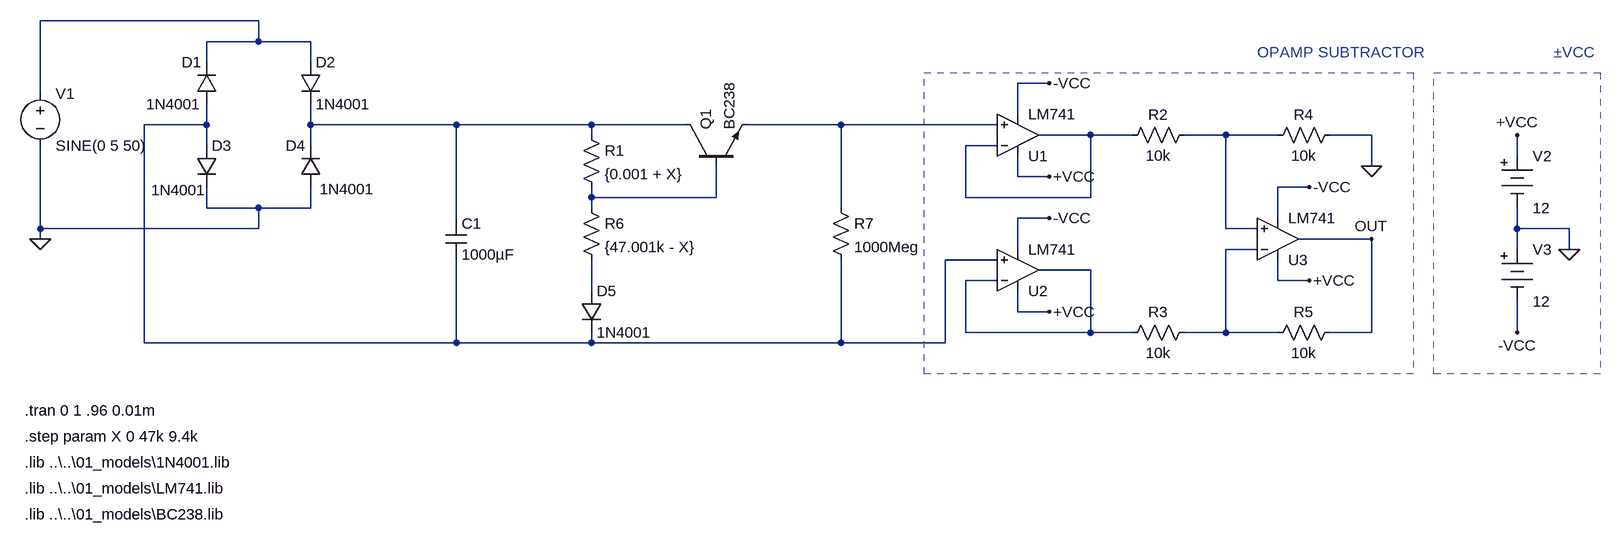
[diagram p0: schematic acdcconv_01_04_02_01_expcir_incrv_pot_simulated_vl.asc]
acdcconv_01_04_02_01_expcir_incrv_pot_simulated_vl.asc, the LTspice schematic file:
Version 4
SHEET 1 2228 872
WIRE 160 96 -176 96
WIRE 160 128 160 96
WIRE 160 128 80 128
WIRE 240 128 160 128
WIRE 80 160 80 128
WIRE 240 160 240 128
WIRE 1376 192 1328 192
WIRE -176 208 -176 96
WIRE 1328 240 1328 192
WIRE 80 256 80 224
WIRE 80 256 -16 256
WIRE 240 256 240 224
WIRE 464 256 240 256
WIRE 672 256 464 256
WIRE 816 256 672 256
WIRE 1056 256 912 256
WIRE 1296 256 1056 256
WIRE 672 272 672 256
WIRE 1440 272 1360 272
WIRE 1504 272 1440 272
WIRE 1648 272 1584 272
WIRE 1728 272 1648 272
WIRE 1872 272 1808 272
WIRE 80 288 80 256
WIRE 240 288 240 256
WIRE 1296 288 1248 288
WIRE 2096 304 2096 272
WIRE 1872 320 1872 272
WIRE 1328 336 1328 304
WIRE 1376 336 1328 336
WIRE 1776 352 1728 352
WIRE 672 368 672 352
WIRE 864 368 864 320
WIRE 864 368 672 368
WIRE 1248 368 1248 288
WIRE 1440 368 1440 272
WIRE 1440 368 1248 368
WIRE 80 384 80 352
WIRE 160 384 80 384
WIRE 240 384 240 352
WIRE 240 384 160 384
WIRE 672 384 672 368
WIRE 1056 384 1056 256
WIRE 464 400 464 256
WIRE 1376 400 1328 400
WIRE 1728 400 1728 352
WIRE -176 416 -176 288
WIRE 160 416 160 384
WIRE 160 416 -176 416
WIRE 1648 416 1648 272
WIRE 1696 416 1648 416
WIRE 2096 416 2096 384
WIRE 2176 416 2096 416
WIRE -176 432 -176 416
WIRE 1872 432 1760 432
WIRE 1328 448 1328 400
WIRE 1696 448 1648 448
WIRE 2096 448 2096 416
WIRE 2176 448 2176 416
WIRE 1296 464 1216 464
WIRE 1440 480 1360 480
WIRE 1296 496 1248 496
WIRE 1728 496 1728 464
WIRE 1776 496 1728 496
WIRE 672 512 672 464
WIRE 1328 544 1328 512
WIRE 1376 544 1328 544
WIRE 1248 576 1248 496
WIRE 1440 576 1440 480
WIRE 1440 576 1248 576
WIRE 1504 576 1440 576
WIRE 1648 576 1648 448
WIRE 1648 576 1584 576
WIRE 1728 576 1648 576
WIRE 1872 576 1872 432
WIRE 1872 576 1808 576
WIRE 2096 576 2096 528
WIRE -16 592 -16 256
WIRE 464 592 464 464
WIRE 464 592 -16 592
WIRE 672 592 672 576
WIRE 672 592 464 592
WIRE 1056 592 1056 464
WIRE 1056 592 672 592
WIRE 1216 592 1216 464
WIRE 1216 592 1056 592
FLAG -176 432 0
FLAG 1872 320 0
FLAG 2176 448 0
FLAG 2096 272 +VCC
FLAG 2096 576 -VCC
FLAG 1376 336 +VCC
FLAG 1376 192 -VCC
FLAG 1376 544 +VCC
FLAG 1376 400 -VCC
FLAG 1776 496 +VCC
FLAG 1776 352 -VCC
FLAG 1872 432 OUT
SYMBOL diode 96 224 R180
WINDOW 0 24 64 Left 2
WINDOW 3 24 0 Left 2
SYMATTR InstName D1
SYMATTR Value 1N4001
SYMBOL diode 224 160 R0
SYMATTR InstName D2
SYMATTR Value 1N4001
SYMBOL diode 64 288 R0
WINDOW 3 -69 69 Left 2
SYMATTR Value 1N4001
SYMATTR InstName D3
SYMBOL diode 256 352 R180
WINDOW 0 24 64 Left 2
WINDOW 3 2 -3 Right 2
SYMATTR InstName D4
SYMATTR Value 1N4001
SYMBOL voltage -176 192 R0
WINDOW 123 0 0 Left 2
WINDOW 39 0 0 Left 2
SYMATTR InstName V1
SYMATTR Value SINE(0 5 50)
SYMBOL Opamps\\opamp2 1328 336 M180
SYMATTR InstName U1
SYMATTR Value LM741
SYMBOL Opamps\\opamp2 1328 544 M180
SYMATTR InstName U2
SYMATTR Value LM741
SYMBOL Opamps\\opamp2 1728 496 M180
SYMATTR InstName U3
SYMATTR Value LM741
SYMBOL res 1600 256 R90
WINDOW 0 0 56 VBottom 2
WINDOW 3 32 56 VTop 2
SYMATTR InstName R2
SYMATTR Value 10k
SYMBOL res 1600 560 R90
WINDOW 0 0 56 VBottom 2
WINDOW 3 32 56 VTop 2
SYMATTR InstName R3
SYMATTR Value 10k
SYMBOL res 1824 256 R90
WINDOW 0 0 56 VBottom 2
WINDOW 3 32 56 VTop 2
SYMATTR InstName R4
SYMATTR Value 10k
SYMBOL res 1824 560 R90
WINDOW 0 0 56 VBottom 2
WINDOW 3 32 56 VTop 2
SYMATTR InstName R5
SYMATTR Value 10k
SYMBOL Misc\\battery 2096 288 R0
WINDOW 123 0 0 Left 2
WINDOW 39 0 0 Left 2
SYMATTR InstName V2
SYMATTR Value 12
SYMBOL Misc\\battery 2096 432 R0
WINDOW 123 0 0 Left 2
WINDOW 39 0 0 Left 2
SYMATTR InstName V3
SYMATTR Value 12
SYMBOL cap 448 400 R0
SYMATTR InstName C1
SYMATTR Value 1000µF
SYMBOL res 656 256 R0
SYMATTR InstName R1
SYMATTR Value {0.001 + X}
SYMBOL diode 656 512 R0
SYMATTR InstName D5
SYMATTR Value 1N4001
SYMBOL res 656 368 R0
SYMATTR InstName R6
SYMATTR Value {47.001k - X}
SYMBOL npn 816 320 R270
SYMATTR InstName Q1
SYMATTR Value BC238
SYMBOL res 1040 368 R0
SYMATTR InstName R7
SYMATTR Value 1000Meg
TEXT -200 696 Left 2 !.tran 0 1 .96 0.01m
TEXT -200 776 Left 2 !.lib ..\\..\\01_models\\1N4001.lib
TEXT -200 816 Left 2 !.lib ..\\..\\01_models\\LM741.lib
TEXT -200 856 Left 2 !.lib ..\\..\\01_models\\BC238.lib
TEXT 1696 144 Left 2 ;OPAMP SUBTRACTOR
TEXT 2152 144 Left 2 ;±VCC
TEXT -200 736 Left 2 !.step param X 0 47k 9.4k
RECTANGLE Normal 1936 640 1184 176 1
RECTANGLE Normal 2224 640 1968 176 1

The netlist it stands for:
* acdcconv_01_04_02_01_expcir_incrv_pot_simulated_vl.asc
D1 N002 N001 1N4001
D2 N001 N003 1N4001
D3 N002 0 1N4001
D4 0 N003 1N4001
V1 N001 0 SINE(0 5 50)
XU1 N004 N005 +VCC -VCC N005 LM741  ; pins In+ In- V+ V- OUT
XU2 N002 N009 +VCC -VCC N009 LM741  ; pins In+ In- V+ V- OUT
XU3 N006 N008 +VCC -VCC OUT LM741  ; pins In+ In- V+ V- OUT
R2 N006 N005 10k
R3 N008 N009 10k
R4 0 N006 10k
R5 OUT N008 10k
V2 +VCC 0 12
V3 0 -VCC 12
C1 N003 N002 1000µF
R1 N003 N007 {0.001 + X}
D5 N010 N002 1N4001
R6 N007 N010 {47.001k - X}
Q1 N003 N007 N004 0 BC238
R7 N004 N002 1000Meg
.model D D
.lib standard.dio
.model NPN NPN
.model PNP PNP
.lib standard.bjt
.tran 0 1 .96 0.01m
.lib ..\..\01_models\1N4001.lib
.lib ..\..\01_models\LM741.lib
.lib ..\..\01_models\BC238.lib
* OPAMP SUBTRACTOR
* ±VCC
.step param X 0 47k 9.4k
.backanno
.end